# Altium schematic sheet MODEM_PT2.SchDoc: MODEM POWER
size 420 x 297 mm; SheetNumber: 8; SheetTotal: 8
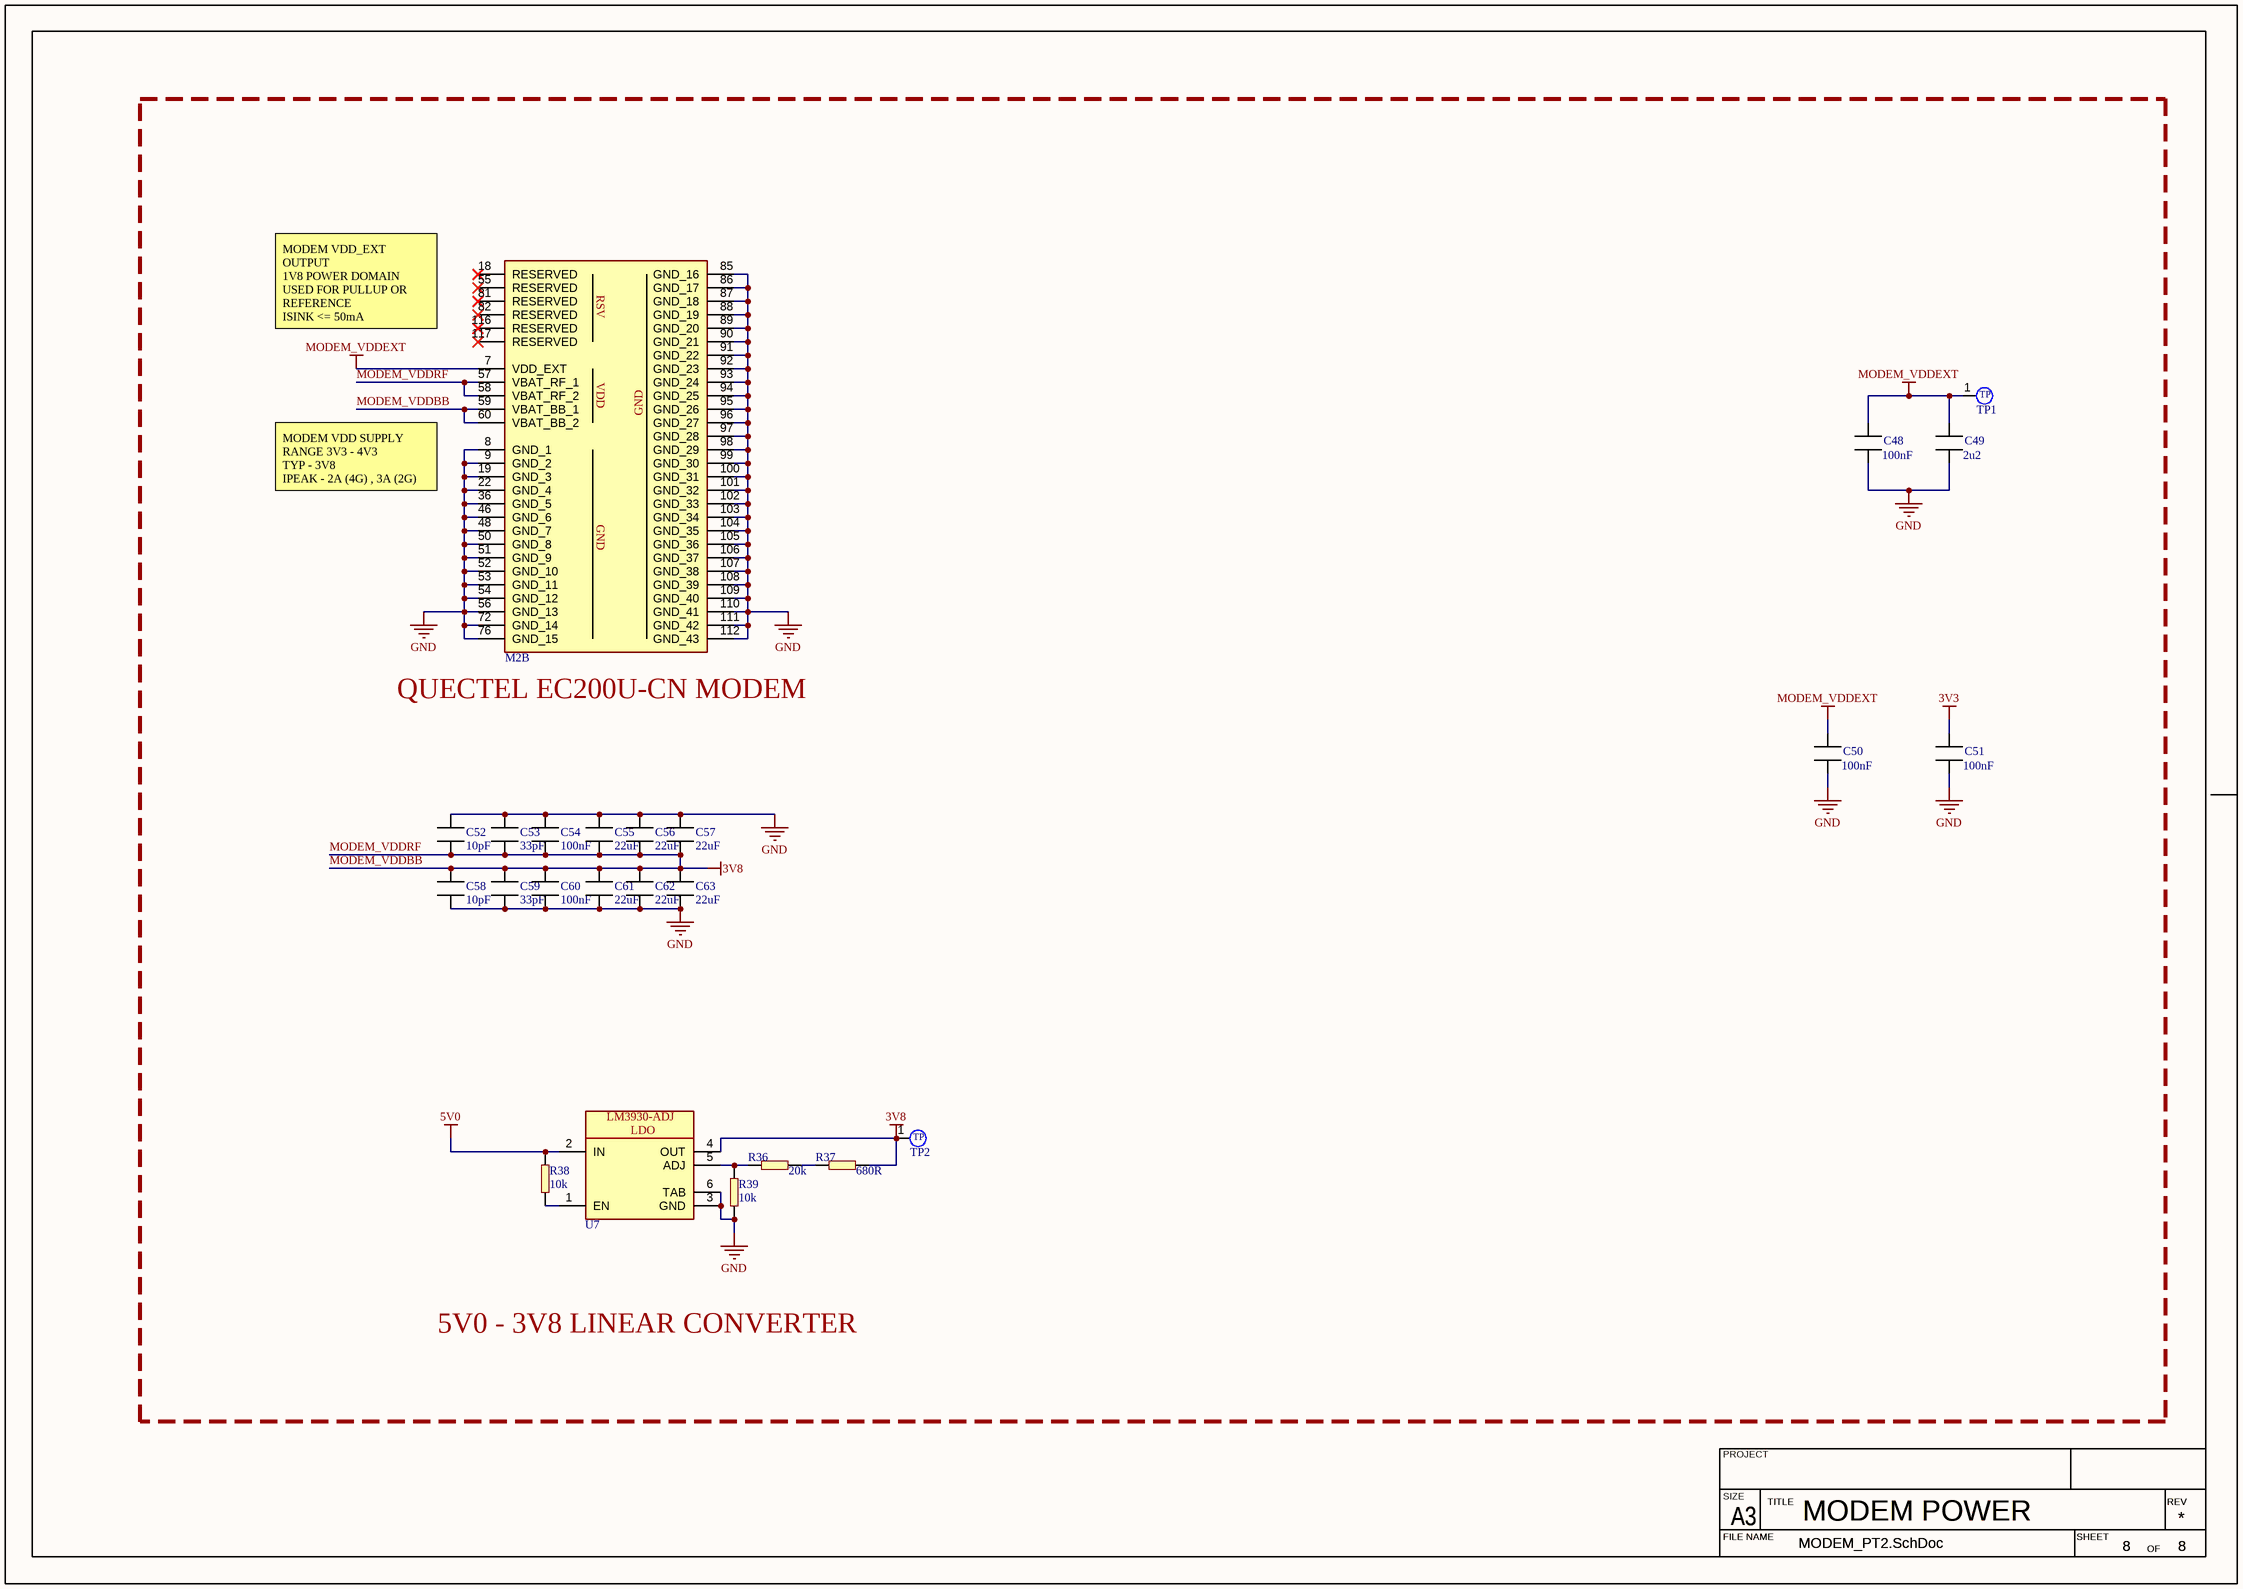
[diagram p0: MODEM_PT2.SchDoc]

## Parts
C48  value 100nF  [CAPC2012X13L]  (hidden comment: MLCC_0805)
C49  value 2u2  [CAPC2012X13L]  (hidden comment: MLCC_0805)
C50  value 100nF  [CAPC2012X13L]  (hidden comment: MLCC_0805)
C51  value 100nF  [CAPC2012X13L]  (hidden comment: MLCC_0805)
C52  value 10pF  [CAPC2012X13L]  (hidden comment: MLCC_0805)
C53  value 33pF  [CAPC2012X13L]  (hidden comment: MLCC_0805)
C54  value 100nF  [CAPC2012X13L]  (hidden comment: MLCC_0805)
C55  value 22uF  [CAPC2012X13L]  (hidden comment: MLCC_0805)
C56  value 22uF  [CAPC2012X13L]  (hidden comment: MLCC_0805)
C57  value 22uF  [CAPC2012X13L]  (hidden comment: MLCC_0805)
C58  value 10pF  [CAPC2012X13L]  (hidden comment: MLCC_0805)
C59  value 33pF  [CAPC2012X13L]  (hidden comment: MLCC_0805)
C60  value 100nF  [CAPC2012X13L]  (hidden comment: MLCC_0805)
C61  value 22uF  [CAPC2012X13L]  (hidden comment: MLCC_0805)
C62  value 22uF  [CAPC2012X13L]  (hidden comment: MLCC_0805)
C63  value 22uF  [CAPC2012X13L]  (hidden comment: MLCC_0805)
M2  EC200U  [EC200U]  (value not drawn)  (part B of 2)
R36  value 20k  [RES_0603]  (hidden comment: ERP_101-1)
R37  value 680R  [RES_0603]  (hidden comment: ERP_101-1)
R38  value 10k  [RES_0603]  (hidden comment: ERP_101-1)
R39  value 10k  [RES_0603]  (hidden comment: ERP_101-1)
TP1  TP_1MM  [TP_1MM]  (value not drawn)  (no BOM)
TP2  TP_1MM  [TP_1MM]  (value not drawn)  (no BOM)
U7  LM39302  [DPAK170P1491X483-6N]  (value not drawn)

## Nets
3V3: C51.1
5V0: R38.1 U7.2(IN)
GND: C48.2 C49.2 C50.2 C51.2 C52.1 C53.1 C54.1 C55.1 C56.1 C57.1 C58.2 C59.2 C60.2 C61.2 C62.2 C63.2 M2.8(GND_1) M2.9(GND_2) M2.19(GND_3) M2.22(GND_4) M2.36(GND_5) M2.46(GND_6) M2.48(GND_7) M2.50(GND_8) M2.51(GND_9) M2.52(GND_10) M2.53(GND_11) M2.54(GND_12) M2.56(GND_13) M2.72(GND_14) M2.76(GND_15) M2.85(GND_16) M2.86(GND_17) M2.87(GND_18) M2.88(GND_19) M2.89(GND_20) M2.90(GND_21) M2.91(GND_22) M2.92(GND_23) M2.93(GND_24) M2.94(GND_25) M2.95(GND_26) M2.96(GND_27) M2.97(GND_28) M2.98(GND_29) M2.99(GND_30) M2.100(GND_31) M2.101(GND_32) M2.102(GND_33) M2.103(GND_34) M2.104(GND_35) M2.105(GND_36) M2.106(GND_37) M2.107(GND_38) M2.108(GND_39) M2.109(GND_40) M2.110(GND_41) M2.111(GND_42) M2.112(GND_43) R39.2 U7.3(GND) U7.6(TAB)
MODEM_VDDBB: C52.2 C53.2 C54.2 C55.2 C56.2 C57.2 C58.1 C59.1 C60.1 C61.1 C62.1 C63.1 M2.57(VBAT_RF_1) M2.58(VBAT_RF_2) M2.59(VBAT_BB_1) M2.60(VBAT_BB_2) R37.1 TP2.1 U7.4(OUT)  [also labelled 3V8, MODEM_VDDRF]
MODEM_VDDEXT: C48.1 C49.1 C50.1 M2.7(VDD_EXT) TP1.1
NetR36_1: R36.1 R37.2
NetR36_2: R36.2 R39.1 U7.5(ADJ)
NetR38_2: R38.2 U7.1(EN)

Not connected (* = marked no-connect by the designer): M2 18(RESERVED)* 55(RESERVED)* 81(RESERVED)* 82(RESERVED)* 116(RESERVED)* 117(RESERVED)*

## Notes on the sheet
- MODEM VDD_EXT OUTPUT
  1V8 POWER DOMAIN
  USED FOR PULLUP OR REFERENCE
  ISINK <= 50mA
- MODEM VDD SUPPLY
  RANGE 3V3 - 4V3
  TYP - 3V8
  IPEAK - 2A (4G) , 3A (2G)
- (near M2) QUECTEL EC200U-CN MODEM
- 5V0 - 3V8 LINEAR CONVERTER
- PROJECT
- SIZE
- FILE NAME
- A3
- TITLE
- SHEET
- OF
- REV
- (in symbol EC200U, part B) RSV; VDD; GND
- (in symbol LM39302) LM3930-ADJ; LDO
- (in symbol TP_1MM) TP

## Library data of the parts
C48-C63 = MLCC_0805: Chip Capacitor, 2-Leads, Body 2.00x1.25mm, IPC High Density; Package: 0805; Manufacturer 1: *; Manufacturer Part Number 1: *
M2 = EC200U: LTE CAT1 MODEM 144 SMD; Manufacturer 1: Quectel; Manufacturer Part Number 1: 027-EC200UCNAA-N05-SGNSA; Value: *
R36-R39 = RES_0603: Package: 0603; Manufacturer 1: *; Manufacturer Part Number 1: *; ERP: *
U7 = LM39302: LM39302R HTC TO263 - Adjustable 3A Low-Voltage Low-Dropout Regulator; Manufacturer Part Number 1: *; Manufacturer 1: *; Value: *